# EAGLE schematic Simple LED Circuit (EAGLE 9.4.2)
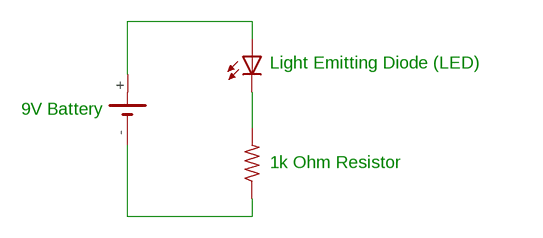
[diagram p0: schematic, sheet 1]

## Parts
9V  SL-150-1/2AA/PR  [SL-150-1/2AA/PR]
LED2  LAP4-BOTTOM  [P47F-BOTTOM]
R1  R-US_0411/12  [0411/12]

## Nets
N$1: 9V.+ LED2.A
N$2: LED2.C R1.2
N$3: 9V.- R1.1

## Notes on the sheet
- Light Emitting Diode (LED)
- 9V Battery
- 1k Ohm Resistor

## Library data of the parts
9V = battery:SL-150-1/2AA/PR: LI BATTERY Sonnenschein
LED2 = led:*P4: PointLED® Enhanced Thinfilm LED TOP & BOTTOM mount LS P47F, LR P47F, LA P47F, LY P47F, LT P4SG, LB P4SG, LW P4SG Source: http://catalog.osram-os.com .. LA_LR_LS_LY_P47F_Pb_free.pdf
R1 = rcl:R-US_: RESISTOR, American symbol